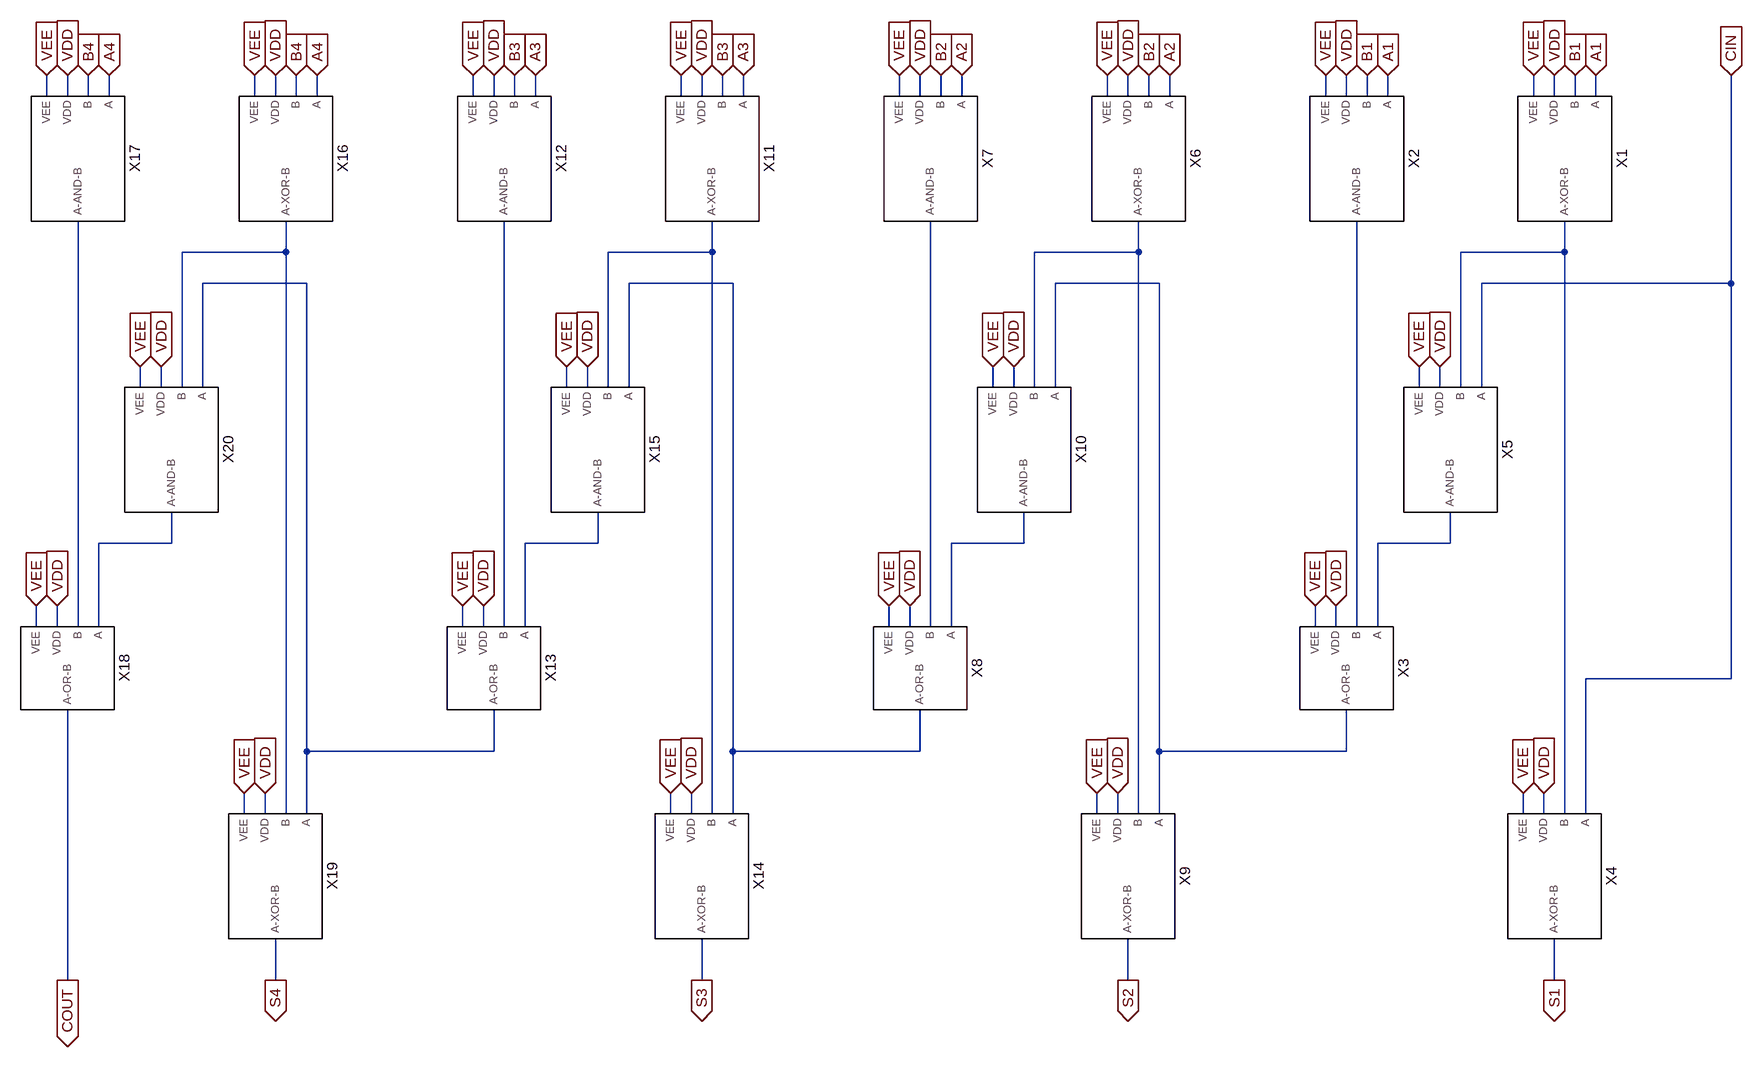
[diagram p0: schematic 4_Bit_Ripple_Carry_Adder_Symbol.asc]
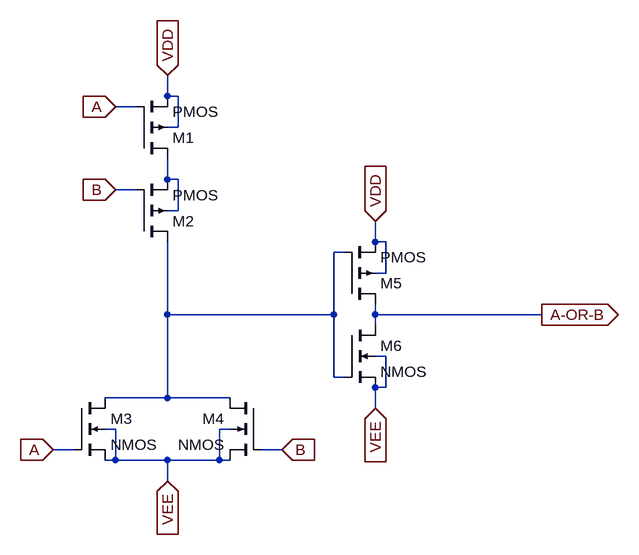
[diagram p1: sub-circuit 2_input_or_gate_symbol.asc]
4_Bit_Ripple_Carry_Adder_Symbol.asc, the LTspice schematic file:
Version 4
SHEET 1 1392 1452
WIRE -1264 -16 -1264 -48
WIRE -1232 -16 -1232 -48
WIRE -1200 -16 -1200 -48
WIRE -1168 -16 -1168 -48
WIRE -944 -16 -944 -48
WIRE -912 -16 -912 -48
WIRE -880 -16 -880 -48
WIRE -848 -16 -848 -48
WIRE -608 -16 -608 -48
WIRE -576 -16 -576 -48
WIRE -544 -16 -544 -48
WIRE -512 -16 -512 -48
WIRE -288 -16 -288 -48
WIRE -256 -16 -256 -48
WIRE -224 -16 -224 -48
WIRE -192 -16 -192 -48
WIRE 48 -16 48 -48
WIRE 80 -16 80 -48
WIRE 112 -16 112 -48
WIRE 144 -16 144 -48
WIRE 368 -16 368 -48
WIRE 400 -16 400 -48
WIRE 432 -16 432 -48
WIRE 464 -16 464 -48
WIRE 704 -16 704 -48
WIRE 736 -16 736 -48
WIRE 768 -16 768 -48
WIRE 800 -16 800 -48
WIRE 1024 -16 1024 -48
WIRE 1056 -16 1056 -48
WIRE 1088 -16 1088 -48
WIRE 1120 -16 1120 -48
WIRE -896 224 -896 176
WIRE -896 224 -1056 224
WIRE -240 224 -240 176
WIRE -240 224 -400 224
WIRE 416 224 416 176
WIRE 416 224 256 224
WIRE 1072 224 1072 176
WIRE 1072 224 912 224
WIRE -864 272 -1024 272
WIRE -208 272 -368 272
WIRE 448 272 288 272
WIRE 1328 272 1328 -48
WIRE 1328 272 944 272
WIRE -1120 432 -1120 400
WIRE -1088 432 -1088 400
WIRE -1056 432 -1056 224
WIRE -1024 432 -1024 272
WIRE -464 432 -464 400
WIRE -432 432 -432 400
WIRE -400 432 -400 224
WIRE -368 432 -368 272
WIRE 192 432 192 400
WIRE 224 432 224 400
WIRE 256 432 256 224
WIRE 288 432 288 272
WIRE 848 432 848 400
WIRE 880 432 880 400
WIRE 912 432 912 224
WIRE 944 432 944 272
WIRE -1072 672 -1072 624
WIRE -1072 672 -1184 672
WIRE -416 672 -416 624
WIRE -416 672 -528 672
WIRE 240 672 240 624
WIRE 240 672 128 672
WIRE 896 672 896 624
WIRE 896 672 784 672
WIRE -1280 800 -1280 768
WIRE -1248 800 -1248 768
WIRE -1216 800 -1216 176
WIRE -1184 800 -1184 672
WIRE -624 800 -624 768
WIRE -592 800 -592 768
WIRE -560 800 -560 176
WIRE -528 800 -528 672
WIRE 32 800 32 768
WIRE 64 800 64 768
WIRE 96 800 96 176
WIRE 128 800 128 672
WIRE 688 800 688 768
WIRE 720 800 720 768
WIRE 752 800 752 176
WIRE 784 800 784 672
WIRE 1328 880 1328 272
WIRE 1328 880 1104 880
WIRE -864 992 -864 272
WIRE -576 992 -576 928
WIRE -576 992 -864 992
WIRE -208 992 -208 272
WIRE 80 992 80 928
WIRE 80 992 -208 992
WIRE 448 992 448 272
WIRE 736 992 736 928
WIRE 736 992 448 992
WIRE -960 1088 -960 1056
WIRE -928 1088 -928 1056
WIRE -896 1088 -896 224
WIRE -864 1088 -864 992
WIRE -304 1088 -304 1056
WIRE -272 1088 -272 1056
WIRE -240 1088 -240 224
WIRE -208 1088 -208 992
WIRE 352 1088 352 1056
WIRE 384 1088 384 1056
WIRE 416 1088 416 224
WIRE 448 1088 448 992
WIRE 1008 1088 1008 1056
WIRE 1040 1088 1040 1056
WIRE 1072 1088 1072 224
WIRE 1104 1088 1104 880
WIRE -1232 1344 -1232 928
WIRE -912 1344 -912 1280
WIRE -256 1344 -256 1280
WIRE 400 1344 400 1280
WIRE 1056 1344 1056 1280
FLAG -1232 -48 VDD
IOPIN -1232 -48 In
FLAG -912 -48 VDD
IOPIN -912 -48 In
FLAG -576 -48 VDD
IOPIN -576 -48 In
FLAG -256 -48 VDD
IOPIN -256 -48 In
FLAG 80 -48 VDD
IOPIN 80 -48 In
FLAG 400 -48 VDD
IOPIN 400 -48 In
FLAG 736 -48 VDD
IOPIN 736 -48 In
FLAG 1056 -48 VDD
IOPIN 1056 -48 In
FLAG 880 400 VDD
IOPIN 880 400 In
FLAG 720 768 VDD
IOPIN 720 768 In
FLAG 1040 1056 VDD
IOPIN 1040 1056 In
FLAG 384 1056 VDD
IOPIN 384 1056 In
FLAG 224 400 VDD
IOPIN 224 400 In
FLAG -432 400 VDD
IOPIN -432 400 In
FLAG -1088 400 VDD
IOPIN -1088 400 In
FLAG -592 768 VDD
IOPIN -592 768 In
FLAG -272 1056 VDD
IOPIN -272 1056 In
FLAG 64 768 VDD
IOPIN 64 768 In
FLAG -928 1056 VDD
IOPIN -928 1056 In
FLAG -1248 768 VDD
IOPIN -1248 768 In
FLAG 1024 -48 VEE
IOPIN 1024 -48 In
FLAG 704 -48 VEE
IOPIN 704 -48 In
FLAG 368 -48 VEE
IOPIN 368 -48 In
FLAG 48 -48 VEE
IOPIN 48 -48 In
FLAG -288 -48 VEE
IOPIN -288 -48 In
FLAG -608 -48 VEE
IOPIN -608 -48 In
FLAG -944 -48 VEE
IOPIN -944 -48 In
FLAG -1264 -48 VEE
IOPIN -1264 -48 In
FLAG -1120 400 VEE
IOPIN -1120 400 In
FLAG -464 400 VEE
IOPIN -464 400 In
FLAG 192 400 VEE
IOPIN 192 400 In
FLAG 848 400 VEE
IOPIN 848 400 In
FLAG 688 768 VEE
IOPIN 688 768 In
FLAG 32 768 VEE
IOPIN 32 768 In
FLAG -624 768 VEE
IOPIN -624 768 In
FLAG -1280 768 VEE
IOPIN -1280 768 In
FLAG -960 1056 VEE
IOPIN -960 1056 In
FLAG -304 1056 VEE
IOPIN -304 1056 In
FLAG 352 1056 VEE
IOPIN 352 1056 In
FLAG 1008 1056 VEE
IOPIN 1008 1056 In
FLAG 1056 1344 S1
IOPIN 1056 1344 Out
FLAG 400 1344 S2
IOPIN 400 1344 Out
FLAG -256 1344 S3
IOPIN -256 1344 Out
FLAG -912 1344 S4
IOPIN -912 1344 Out
FLAG -1232 1344 COUT
IOPIN -1232 1344 Out
FLAG 1120 -48 A1
IOPIN 1120 -48 In
FLAG 800 -48 A1
IOPIN 800 -48 In
FLAG 464 -48 A2
IOPIN 464 -48 In
FLAG 144 -48 A2
IOPIN 144 -48 In
FLAG -192 -48 A3
IOPIN -192 -48 In
FLAG -512 -48 A3
IOPIN -512 -48 In
FLAG -848 -48 A4
IOPIN -848 -48 In
FLAG -1168 -48 A4
IOPIN -1168 -48 In
FLAG 1088 -48 B1
IOPIN 1088 -48 In
FLAG 768 -48 B1
IOPIN 768 -48 In
FLAG 432 -48 B2
IOPIN 432 -48 In
FLAG 112 -48 B2
IOPIN 112 -48 In
FLAG -224 -48 B3
IOPIN -224 -48 In
FLAG -544 -48 B3
IOPIN -544 -48 In
FLAG -880 -48 B4
IOPIN -880 -48 In
FLAG -1200 -48 B4
IOPIN -1200 -48 In
FLAG 1328 -48 CIN
IOPIN 1328 -48 In
SYMBOL 2_Input_XOR_Gate_Symbol 1072 80 R90
SYMATTR InstName X1
SYMBOL 2_Input_AND_Gate_Symbol 752 80 R90
SYMATTR InstName X2
SYMBOL 2_Input_OR_Gate_Symbol 736 864 R90
SYMATTR InstName X3
SYMBOL 2_Input_XOR_Gate_Symbol 1056 1184 R90
SYMATTR InstName X4
SYMBOL 2_Input_AND_Gate_Symbol 896 528 R90
SYMATTR InstName X5
SYMBOL 2_Input_XOR_Gate_Symbol 416 80 R90
SYMATTR InstName X6
SYMBOL 2_Input_AND_Gate_Symbol 96 80 R90
SYMATTR InstName X7
SYMBOL 2_Input_OR_Gate_Symbol 80 864 R90
SYMATTR InstName X8
SYMBOL 2_Input_XOR_Gate_Symbol 400 1184 R90
SYMATTR InstName X9
SYMBOL 2_Input_AND_Gate_Symbol 240 528 R90
SYMATTR InstName X10
SYMBOL 2_Input_XOR_Gate_Symbol -240 80 R90
SYMATTR InstName X11
SYMBOL 2_Input_AND_Gate_Symbol -560 80 R90
SYMATTR InstName X12
SYMBOL 2_Input_OR_Gate_Symbol -576 864 R90
SYMATTR InstName X13
SYMBOL 2_Input_XOR_Gate_Symbol -256 1184 R90
SYMATTR InstName X14
SYMBOL 2_Input_AND_Gate_Symbol -416 528 R90
SYMATTR InstName X15
SYMBOL 2_Input_XOR_Gate_Symbol -896 80 R90
SYMATTR InstName X16
SYMBOL 2_Input_AND_Gate_Symbol -1216 80 R90
SYMATTR InstName X17
SYMBOL 2_Input_OR_Gate_Symbol -1232 864 R90
SYMATTR InstName X18
SYMBOL 2_Input_XOR_Gate_Symbol -912 1184 R90
SYMATTR InstName X19
SYMBOL 2_Input_AND_Gate_Symbol -1072 528 R90
SYMATTR InstName X20

2_input_or_gate_symbol.asc, the sub-circuit schematic file:
Version 4
SHEET 1 1612 1096
WIRE 912 416 912 384
WIRE 928 416 912 416
WIRE 864 432 832 432
WIRE 928 464 928 416
WIRE 928 464 912 464
WIRE 912 544 912 512
WIRE 928 544 912 544
WIRE 864 560 832 560
WIRE 928 592 928 544
WIRE 928 592 912 592
WIRE 1232 640 1232 608
WIRE 1248 640 1232 640
WIRE 1184 656 1168 656
WIRE 1248 688 1248 640
WIRE 1248 688 1232 688
WIRE 912 752 912 640
WIRE 1168 752 1168 656
WIRE 1168 752 912 752
WIRE 1232 752 1232 736
WIRE 1488 752 1232 752
WIRE 1232 768 1232 752
WIRE 1248 816 1232 816
WIRE 1168 848 1168 752
WIRE 1184 848 1168 848
WIRE 1248 864 1248 816
WIRE 1248 864 1232 864
WIRE 912 880 912 752
WIRE 912 880 816 880
WIRE 1008 880 912 880
WIRE 1232 896 1232 864
WIRE 832 928 816 928
WIRE 1008 928 992 928
WIRE 768 960 736 960
WIRE 1088 960 1056 960
WIRE 832 976 832 928
WIRE 832 976 816 976
WIRE 912 976 832 976
WIRE 992 976 992 928
WIRE 992 976 912 976
WIRE 1008 976 992 976
WIRE 912 1008 912 976
FLAG 912 384 VDD
IOPIN 912 384 In
FLAG 912 1008 VEE
IOPIN 912 1008 In
FLAG 1232 896 VEE
IOPIN 1232 896 In
FLAG 1232 608 VDD
IOPIN 1232 608 In
FLAG 1488 752 A-OR-B
IOPIN 1488 752 Out
FLAG 832 432 A
IOPIN 832 432 In
FLAG 736 960 A
IOPIN 736 960 In
FLAG 1088 960 B
IOPIN 1088 960 In
FLAG 832 560 B
IOPIN 832 560 In
SYMBOL pmos4 864 512 M180
SYMATTR InstName M1
SYMBOL pmos4 864 640 M180
SYMATTR InstName M2
SYMBOL nmos4 768 880 R0
SYMATTR InstName M3
SYMBOL nmos4 1056 880 M0
SYMATTR InstName M4
SYMBOL pmos4 1184 736 M180
SYMATTR InstName M5
SYMBOL nmos4 1184 768 R0
SYMATTR InstName M6

The netlist it stands for:
* 4_Bit_Ripple_Carry_Adder_Symbol.asc
XX1 A1 B1 VDD VEE N004 2_Input_XOR_Gate_Symbol  ; pins A B VDD VEE A-XOR-B
XX2 A1 B1 VDD VEE N015 2_Input_AND_Gate_Symbol  ; pins A B VDD VEE A-AND-B
XX3 N011 N015 VDD VEE N007 2_input_or_gate_symbol
XX4 CIN N004 VDD VEE S1 2_Input_XOR_Gate_Symbol  ; pins A B VDD VEE A-XOR-B
XX5 CIN N004 VDD VEE N011 2_Input_AND_Gate_Symbol  ; pins A B VDD VEE A-AND-B
XX6 A2 B2 VDD VEE N003 2_Input_XOR_Gate_Symbol  ; pins A B VDD VEE A-XOR-B
XX7 A2 B2 VDD VEE N014 2_Input_AND_Gate_Symbol  ; pins A B VDD VEE A-AND-B
XX8 N010 N014 VDD VEE N006 2_input_or_gate_symbol
XX9 N007 N003 VDD VEE S2 2_Input_XOR_Gate_Symbol  ; pins A B VDD VEE A-XOR-B
XX10 N007 N003 VDD VEE N010 2_Input_AND_Gate_Symbol  ; pins A B VDD VEE A-AND-B
XX11 A3 B3 VDD VEE N002 2_Input_XOR_Gate_Symbol  ; pins A B VDD VEE A-XOR-B
XX12 A3 B3 VDD VEE N013 2_Input_AND_Gate_Symbol  ; pins A B VDD VEE A-AND-B
XX13 N009 N013 VDD VEE N005 2_input_or_gate_symbol
XX14 N006 N002 VDD VEE S3 2_Input_XOR_Gate_Symbol  ; pins A B VDD VEE A-XOR-B
XX15 N006 N002 VDD VEE N009 2_Input_AND_Gate_Symbol  ; pins A B VDD VEE A-AND-B
XX16 A4 B4 VDD VEE N001 2_Input_XOR_Gate_Symbol  ; pins A B VDD VEE A-XOR-B
XX17 A4 B4 VDD VEE N012 2_Input_AND_Gate_Symbol  ; pins A B VDD VEE A-AND-B
XX18 N008 N012 VDD VEE COUT 2_input_or_gate_symbol
XX19 N005 N001 VDD VEE S4 2_Input_XOR_Gate_Symbol  ; pins A B VDD VEE A-XOR-B
XX20 N005 N001 VDD VEE N008 2_Input_AND_Gate_Symbol  ; pins A B VDD VEE A-AND-B

* block symbol definitions
.subckt 2_input_or_gate_symbol A B VDD VEE A-OR-B
M1 N001 A VDD VDD PMOS
M2 N002 B N001 N001 PMOS
M3 N002 A VEE VEE NMOS
M4 N002 B VEE VEE NMOS
M5 A-OR-B N002 VDD VDD PMOS
M6 A-OR-B N002 VEE VEE NMOS
.ends 2_input_or_gate_symbol

.model NMOS NMOS
.model PMOS PMOS
.lib standard.mos
.backanno
.end